# Altium project allaki_mezzanine.PrjPCB (part 2 of 2)

## Sheet FP_connectors.SchDoc: =ProjectName
size 420 x 297 mm; Author: SBH; CompanyName: WUT; DrawnBy: SBH; Organization: ISE-WUT; Address1: Warsaw Univeristy of Technology; Address2: Nowowiejska 15/19; Revision: -; SheetNumber: -; SheetTotal: -; EDA_Number: ARTIQ; Projet: ADC/DAC MEZZANINE; ModifiedBy: -; CreateDate: XX/XX/XXXX; CheckedDate: -; Title2: FP_connectors.SchDoc; DivGrp: ISE; Designer: SBH; ModifiedDate: -; ProjectName: ADC/DAC MEZZANINE
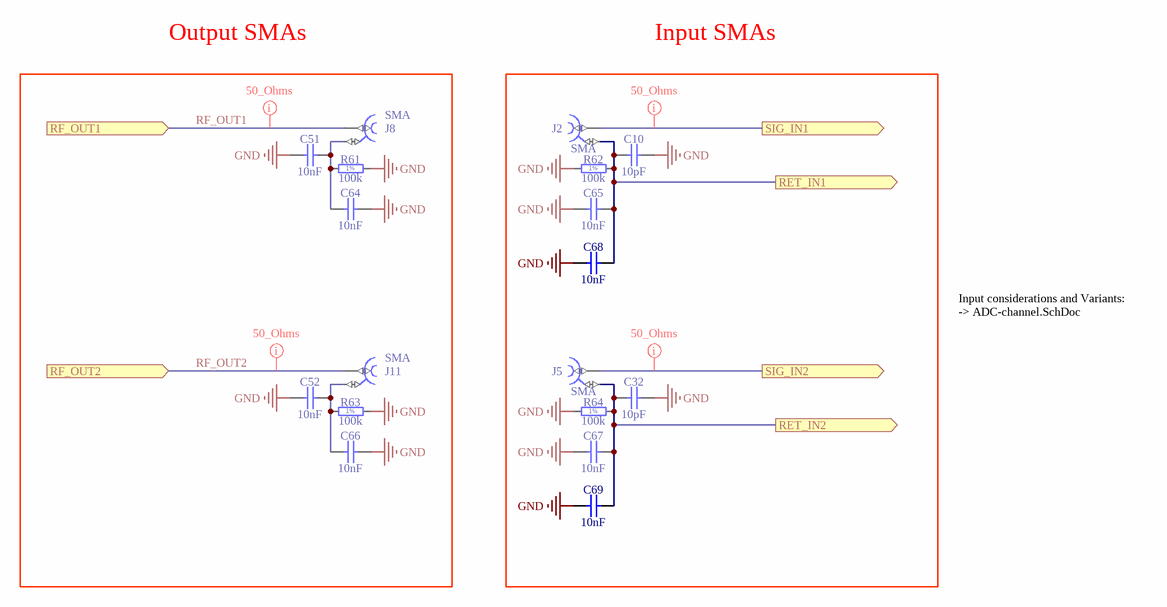
[diagram p3: FP_connectors.SchDoc]

### Parts
C10  10pF  [CAPC1005X55N]
C32  10pF  [CAPC1005X55N]
C51  10nF  [CAPC1005X55N]
C52  10nF  [CAPC1005X55N]
C64  10nF  [CAPC1005X55N]
C65  10nF  [CAPC1005X55N]
C66  10nF  [CAPC1005X55N]
C67  10nF  [CAPC1005X55N]
C68  10nF  [CAPC1005X55N]
C69  10nF  [CAPC1005X55N]
J2  SMA  [Telegartner_J01151A0921]
J5  SMA  [Telegartner_J01151A0921]
J8  SMA  [TELEGARTNER_J01151A0451]
J11  SMA  [TELEGARTNER_J01151A0451]
R61  100k  [RESC1005X40N]
R62  100k  [RESC1005X40N]
R63  100k  [RESC1005X40N]
R64  100k  [RESC1005X40N]

### Ports
RET_IN1 (out), RET_IN2 (out), RF_OUT1 (in), RF_OUT2 (in), SIG_IN1 (out), SIG_IN2 (out)

### Nets
GND: C10.2 C32.2 C51.1 C52.1 C64.2 C65.1 C66.2 C67.1 C68.1 C69.1 R61.1 R62.1 R63.1 R64.1
RET1_IN: C10.1 C65.2 C68.2 J2.2 R62.2 ; port RET_IN1
RET2_IN: C32.1 C67.2 C69.2 J5.2 R64.2 ; port RET_IN2
RF_OUT1: J8.1 ; port RF_OUT1  [project net RF1_OUT]
RF_OUT2: J11.1 ; port RF_OUT2  [project net RF2_OUT]
SIG1_IN: J2.1 ; port SIG_IN1
SIG2_IN: J5.1 ; port SIG_IN2
NetC51_2: C51.2 C64.1 J8.2 R61.2
NetC52_2: C52.2 C66.1 J11.2 R63.2

### Layout directives
net class 50_Ohms: RF1_OUT, RF2_OUT, SIG1_IN, SIG2_IN

### Notes on the sheet
- Output SMAs
- Input SMAs
- Input considerations and Variants:
  -> ADC-channel.SchDoc
- Project/Equipment
- Document
- Designer
- Drawn by
- Check.by
- File
- Last Mod.
- Print Date
- Sheet
- Size
- A3
- of
- Rev
- (in symbol R0402_100K_1%_0.0625W_100PPM) 1%

### Library data of the parts
C10 C32 = CC0402_10PF_50V_5%_C0G: Non-polarised capacitor; Part Description: SMD Multilayer Chip Ceramic Capacitor; Manufacturer: GENERIC; Manufacturer1 Part Number: C0402C100J5GACTU; Voltage: 50V; TC: C0G/NP0; Tolerance: ±5%; Part Number: CC0402_10PF_50V_5%_C0G; Component Kind: Standard; Component Type: Standard; Pin Count: 2; Value: 10pF; Status: Preferred; Manufacturer Part Number: CC0402_10PF_50V_5%_C0G; Case: 0402; Mounted: Yes; Socket: No; SMD: Yes; Sense: No; Manufacturer1 Example: KEMET; Manufacturer1 ComponentHeight: 0.55mm; HelpURL: \\cern.ch\dfs\Applications\Altium\Datasheets\CC0805_C0G_KEMET_(Commercial Grade).pdf; Author: CERN DEM JLC; CreateDate: 2007-12-03; LatestRevisionDate: 2015-04-22
C51 C52 C64-C69 = CC0402_10NF_16V_10%_X7R: Non-polarised capacitor; Part Description: SMD Multilayer Chip Ceramic Capacitor; Manufacturer: GENERIC; Manufacturer1 Part Number: 223878715636; Voltage: 16V; TC: X7R; Tolerance: ±10%; Part Number: CC0402_10NF_16V_10%_X7R; Component Kind: Standard; Component Type: Standard; Pin Count: 2; Value: 10nF; Status: Not Recommended; Manufacturer Part Number: CC0402_10NF_16V_10%_X7R; Case: 0402; Mounted: Yes; Socket: No; SMD: Yes; Sense: No; Manufacturer1 Example: PHYCOMP; Manufacturer1 ComponentHeight: 0.55mm; HelpURL: \\cern.ch\dfs\Applications\Altium\Datasheets\CC0402_X7R_PHYCOMP.pdf; Author: CERN DEM JLC; CreateDate: 2007-12-03; LatestRevisionDate: 2007-12-03
J2 J5 = SMA_RA_J01151A0921: RiSMA 50 Ohms Right Angle PCB Jack; Manufacturer: Telegartner; PressFit: No; Part Number: Telegartner_J01151A0921; Component Kind: Standard; Component Type: Standard; Pin Count: 2; Family: SMA; Mounted: Yes; Socket: No; SMD: No; Sense: No; Status: None; Part Description: SMA 50 Ohms Right Angle PCB Jack; Manufacturer Part Number: J01151A0921; ComponentHeight: 9.6mm; HelpURL: \\cern.ch\dfs\Applications\Altium\Datasheets\HUBER-SUHNER_85_SMA-50-0-101-111_NE.pdf; Author: GK; CreateDate: 11.11.2016; LatestRevisionDate: 11.11.2016
J8 J11 = TELEGARTNER_J01151A0451: Part Description: SMA 50 ohms Edge Mount Bulkhead Jack Receptacle; PressFit: No; Part Number: TELEGARTNER_J01151A0451; Component Kind: Standard; Component Type: Standard; Pin Count: 2; Family: SMA; Mounted: Yes; Socket: No; SMD: No; Sense: No; Status: None; Manufacturer: TELEGARTNER; Manufacturer Part Number: J01151A0451; ComponentHeight: 7mm; HelpURL: \\cern.ch\dfs\Applications\Altium\Datasheets\TELEGARTNER_J01151A0451.pdf; Author: CERN DEM JLC; CreateDate: 27.10.2016; LatestRevisionDate: 27.10.2016
R61-R64 = R0402_100K_1%_0.0625W_100PPM: Resistor - 1%; Part Description: General Purpose Thick Film Chip Resistor; Manufacturer: GENERIC; Manufacturer1 Part Number: 232270671004L; TC: ±100ppm/°C; Part Number: R0402_100K_1%_0.0625W_100PPM; Component Kind: Standard; Component Type: Standard; Pin Count: 2; Value: 100k; Status: Not recommended; Power: 0.0625W; Tolerance: ±1%; Manufacturer Part Number: R0402_100K_1%_0.0625W_100PPM; Case: 0402; Mounted: Yes; Sense: No; Socket: No; SMD: Yes; Manufacturer1 Example: YAGEO PHYCOMP; Manufacturer1 ComponentHeight: 0.4mm; HelpURL: \\cern.ch\dfs\Applications\Altium\Datasheets\R0402_Phycomp_RC0402.pdf; Author: CERN DEM JLC; CreateDate: 2007-12-03; LatestRevisionDate: 2012-10-17

## Sheet B2B_connectors .SchDoc: =ProjectName
size 420 x 297 mm; Author: SBH; CompanyName: WUT; DrawnBy: SBH; Organization: ISE-WUT; Address1: Warsaw Univeristy of Technology; Address2: Nowowiejska 15/19; Revision: -; SheetNumber: -; SheetTotal: -; EDA_Number: ARTIQ; Projet: ADC/DAC MEZZANINE; ModifiedBy: -; CreateDate: XX/XX/XXXX; CheckedDate: -; Title2: B2B_connectors .SchDoc; DivGrp: ISE; Designer: SBH; ModifiedDate: -; ProjectName: ADC/DAC MEZZANINE
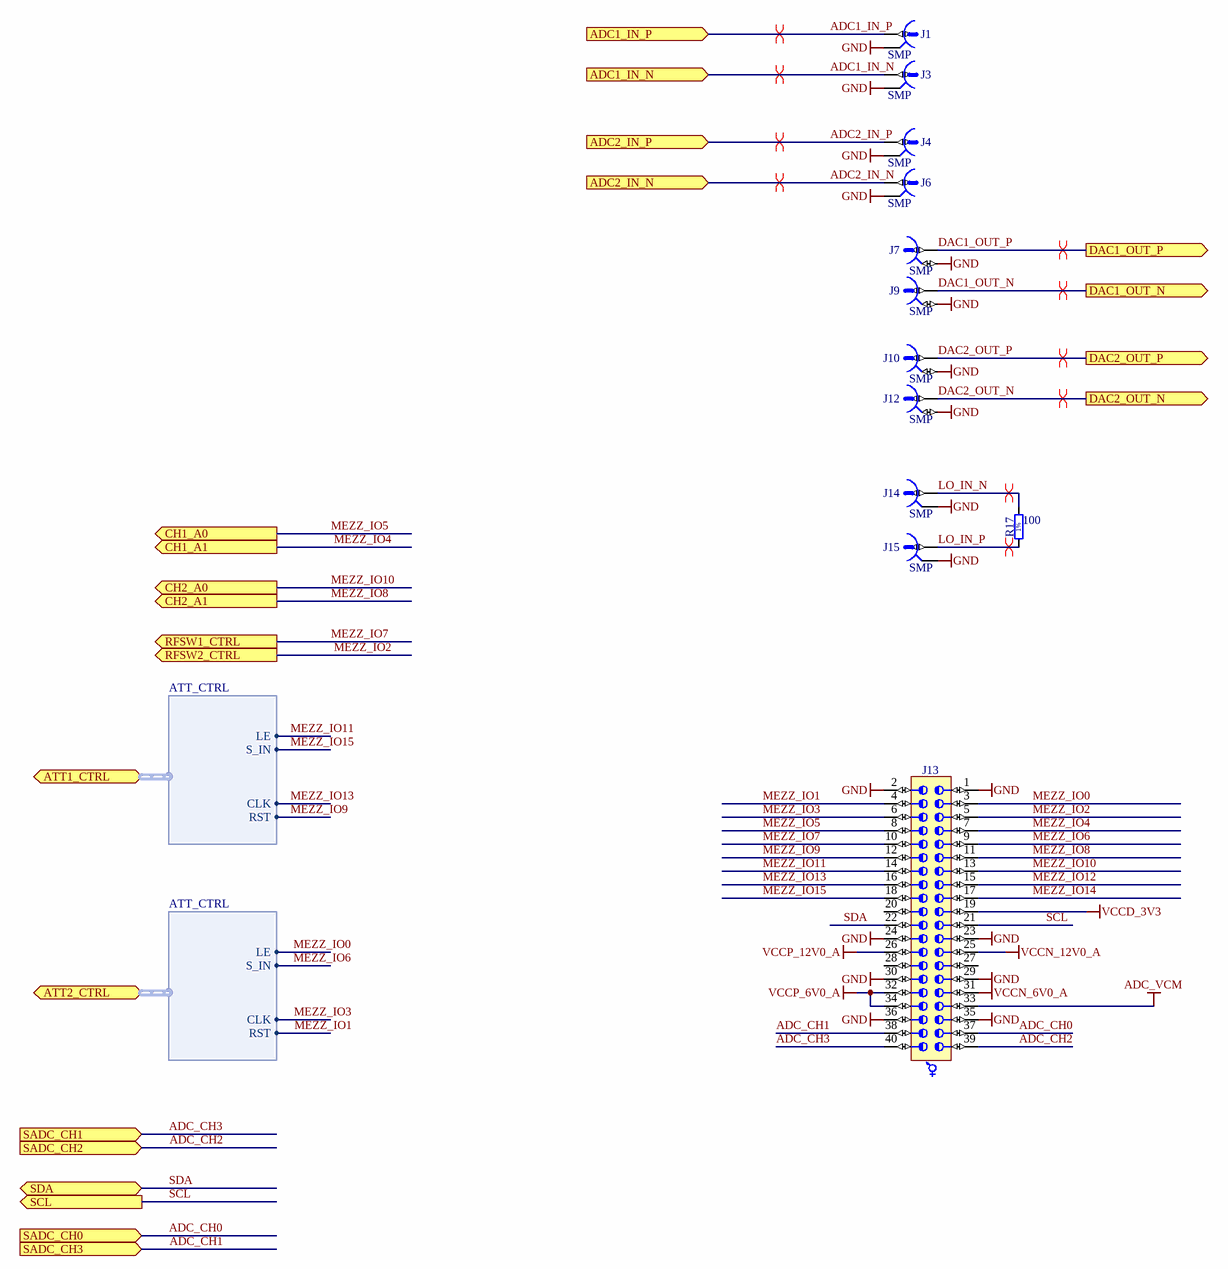
[diagram p4: B2B_connectors .SchDoc]

### Parts
J1  SMP  [AMPHENOL_SMP-MSLD-PCT-10]
J3  SMP  [AMPHENOL_SMP-MSLD-PCT-10]
J4  SMP  [AMPHENOL_SMP-MSLD-PCT-10]
J6  SMP  [AMPHENOL_SMP-MSLD-PCT-10]
J7  SMP  [MOLEX_85305-0232]
J9  SMP  [MOLEX_85305-0232]
J10  SMP  [MOLEX_85305-0232]
J12  SMP  [MOLEX_85305-0232]
J13  (no value)  [SAMTEC_LSS-120-02-L-DV-A]
J14  SMP  [AMPHENOL_SMP-MSLD-PCT-10]
J15  SMP  [AMPHENOL_SMP-MSLD-PCT-10]
R17  100  [RESC1005X40N]

### Ports
ADC1_IN_N (in), ADC1_IN_P (in), ADC2_IN_N (in), ADC2_IN_P (in), ATT1_CTRL (harness ATT_CTRL), ATT2_CTRL (harness ATT_CTRL), CH1_A0 (out), CH1_A1 (out), CH2_A0 (out), CH2_A1 (out), DAC1_OUT_N (out), DAC1_OUT_P (out), DAC2_OUT_N (out), DAC2_OUT_P (out), RFSW1_CTRL (out), RFSW2_CTRL (out), SADC_CH0 (in), SADC_CH1 (in), SADC_CH2 (in), SADC_CH3 (in), SCL (out), SDA (bidir)

### Harnesses
ATT_CTRL: LE, S_IN, CLK, RST

### Nets
ADC_VCM: J13.33
GND: J1.2 J3.2 J4.2 J6.2 J7.2 J9.2 J10.2 J12.2 J13.1 J13.2 J13.23 J13.24 J13.29 J13.30 J13.35 J13.36 J14.2 J15.2
VCCD_3V3: J13.19
VCCN_6V0_A: J13.31
VCCN_12V0_A: J13.25
VCCP_6V0_A: J13.32 J13.34
VCCP_12V0_A: J13.26
ADC1_IN_N: J3.1 ; port ADC1_IN_N
ADC1_IN_P: J1.1 ; port ADC1_IN_P
ADC2_IN_N: J6.1 ; port ADC2_IN_N
ADC2_IN_P: J4.1 ; port ADC2_IN_P
ADC_CH0: J13.37 ; port SADC_CH0
ADC_CH1: J13.38 ; port SADC_CH3
ADC_CH2: J13.39 ; port SADC_CH2
ADC_CH3: J13.40 ; port SADC_CH1
DAC1_OUT_N: J9.1 ; port DAC1_OUT_N
DAC1_OUT_P: J7.1 ; port DAC1_OUT_P
DAC2_OUT_N: J12.1 ; port DAC2_OUT_N
DAC2_OUT_P: J10.1 ; port DAC2_OUT_P
LO_IN_N: J14.1 R17.2
LO_IN_P: J15.1 R17.1
MEZZ_IO0: J13.3 ; port ATT2_CTRL.LE  [project net ATT2_CTRL.LE]
MEZZ_IO1: J13.4 ; port ATT2_CTRL.RST  [project net ATT2_CTRL.RST]
MEZZ_IO2: J13.5 ; port RFSW2_CTRL
MEZZ_IO3: J13.6 ; port ATT2_CTRL.CLK  [project net ATT2_CTRL.CLK]
MEZZ_IO4: J13.7 ; port CH1_A1
MEZZ_IO5: J13.8 ; port CH1_A0
MEZZ_IO6: J13.9 ; port ATT2_CTRL.S_IN  [project net ATT2_CTRL.S_IN]
MEZZ_IO7: J13.10 ; port RFSW1_CTRL
MEZZ_IO8: J13.11 ; port CH2_A1
MEZZ_IO9: J13.12 ; port ATT1_CTRL.RST  [project net ATT1_CTRL.RST]
MEZZ_IO10: J13.13 ; port CH2_A0
MEZZ_IO11: J13.14 ; port ATT1_CTRL.LE  [project net ATT1_CTRL.LE]
MEZZ_IO12: J13.15
MEZZ_IO13: J13.16 ; port ATT1_CTRL.CLK  [project net ATT1_CTRL.CLK]
MEZZ_IO14: J13.17
MEZZ_IO15: J13.18 ; port ATT1_CTRL.S_IN  [project net ATT1_CTRL.S_IN]
SCL: J13.21 ; port SCL
SDA: J13.22 ; port SDA

Not connected (* = marked no-connect by the designer): J13 20 27 28

### Layout directives
differential pair: ADC1_IN_N, ADC1_IN_P, ADC2_IN_N, ADC2_IN_P, DAC1_OUT_N, DAC1_OUT_P, DAC2_OUT_N, DAC2_OUT_P, LO_IN_N, LO_IN_P

### Notes on the sheet
- Project/Equipment
- Document
- Designer
- Drawn by
- Check.by
- File
- Last Mod.
- Print Date
- Sheet
- Size
- A3
- of
- Rev
- (in symbol R0402_100R_1%_0.0625W_100PPM) 1%

### Library data of the parts
J1 J3 J4 J6 J14 J15 = CON_SMP-MSLD-PCT-10: 50 Ohms, SMP Surface/THT Mount Plug, Limited Detent; Part Description: 50 Ohms, SMP Surface Mount Plug, Limited Detent; Manufacturer: AMPHENOL; PressFit: No; Part Number: AMPHENOL_SMP-MSLD-PCT-10; Component Kind: Standard; Component Type: Standard; Pin Count: 2; Family: SMP; Mounted: Yes; Socket: No; SMD: No; Sense: No; Status: None; Manufacturer Part Number: SMP-MSLD-PCT-10; ComponentHeight: 4.1mm; HelpURL: \\cern.ch\dfs\Applications\Altium\Datasheets\MOLEX_85305-0232.pdf; Author: GK; CreateDate: 11.11.2016; LatestRevisionDate: 11.11.2016
J7 J9 J10 J12 = MOLEX_85305-0232: Part Description: 50 Ohms, SMP Surface Mount Plug, Limited Detent; Manufacturer: MOLEX; PressFit: No; Part Number: MOLEX_85305-0232; Component Kind: Standard; Component Type: Standard; Pin Count: 2; Family: SMP; Mounted: Yes; Socket: No; SMD: Yes; Sense: No; Status: None; Manufacturer Part Number: 85305-0232; ComponentHeight: 4.1mm; HelpURL: \\cern.ch\dfs\Applications\Altium\Datasheets\MOLEX_85305-0232.pdf; Author: CERN DEM JMW; CreateDate: 09.08.2016; LatestRevisionDate: 09.08.2016
J13 = CON_SAMTEC_LSS-120-02-L-DV-A: 40 Contacts, Pitch 0.635mm, Razor Beam LSS Vertical High Speed Hermaphroditic Strip (Lead Style 7.49mm); Part Description: 40 Contacts, Pitch 0.635mm, Razor Beam LSS Vertical High Speed Hermaphroditic Strip (Lead Style 5.49mm); Manufacturer: SAMTEC; PressFit: No; Part Number: SAMTEC_LSS-120-02-L-DV-A; Component Kind: Standard; Component Type: Standard; Pin Count: 40; Mounted: Yes; Socket: No; Sense: No; SMD: Yes; Status: None; Manufacturer Part Number: LSS-120-02-L-DV-A; ComponentHeight: 5.57mm; HelpURL: \\cern.ch\dfs\Applications\Altium\Datasheets\SAMTEC_LSS-120-03-L-DV-A.pdf; Author: CERN DEM JMW; CreateDate: 10.11.2015; LatestRevisionDate: 10.11.2015
R17 = R0402_100R_1%_0.0625W_100PPM: Resistor - 1%; Part Description: General Purpose Thick Film Chip Resistor; Manufacturer: GENERIC; Manufacturer1 Part Number: 232270671001L; TC: ±100ppm/°C; Part Number: R0402_100R_1%_0.0625W_100PPM; Component Kind: Standard; Component Type: Standard; Pin Count: 2; Value: 100; Status: Not recommended; Power: 0.0625W; Tolerance: ±1%; Manufacturer Part Number: R0402_100R_1%_0.0625W_100PPM; Case: 0402; Mounted: Yes; Sense: No; Socket: No; SMD: Yes; Manufacturer1 Example: YAGEO PHYCOMP; Manufacturer1 ComponentHeight: 0.4mm; HelpURL: \\cern.ch\dfs\Applications\Altium\Datasheets\R0402_Phycomp_RC0402.pdf; Author: CERN DEM JLC; CreateDate: 03.12.2007; LatestRevisionDate: 17.10.2012

## Sheet PowerSupply.SchDoc: =ProjectName
size 420 x 297 mm; Author: SBH; CompanyName: WUT; DrawnBy: SBH; Organization: ISE-WUT; Address1: Warsaw Univeristy of Technology; Address2: Nowowiejska 15/19; Revision: -; SheetNumber: -; SheetTotal: -; EDA_Number: ARTIQ; Projet: ADC/DAC MEZZANINE; ModifiedBy: -; CreateDate: XX/XX/XXXX; CheckedDate: -; Title2: PowerSupply.SchDoc; DivGrp: ISE; Designer: SBH; ModifiedDate: -; ProjectName: ADC/DAC MEZZANINE
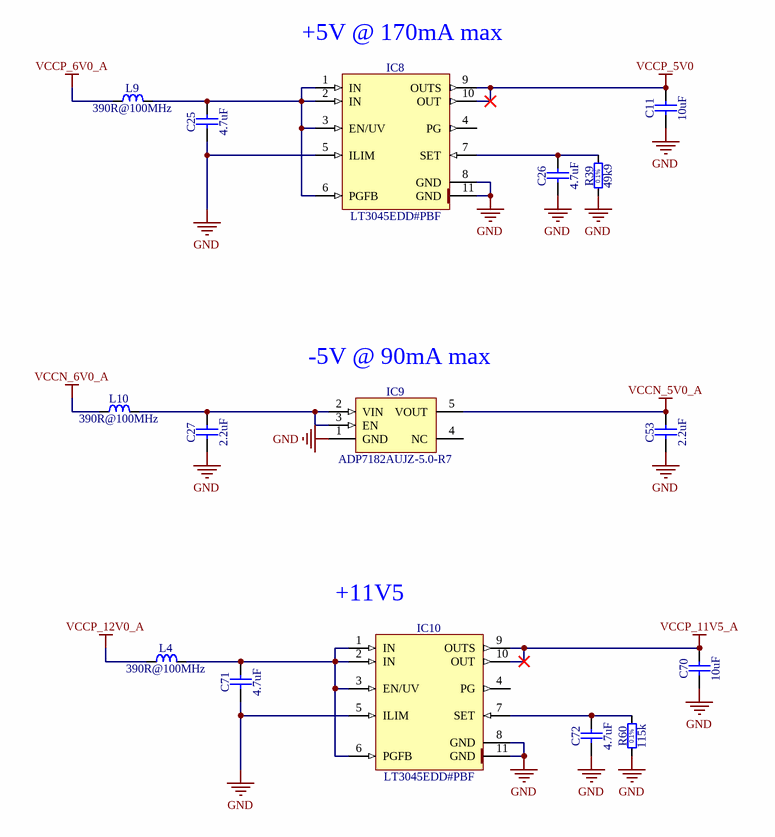
[diagram p5: PowerSupply.SchDoc]

### Parts
C11  10uF  [CAPC1608X87N]
C25  4.7uF  [CAPC1709X95N]
C26  4.7uF  [CAPC1709X95N]
C27  2.2uF  [CAPC1608X90N]
C53  2.2uF  [CAPC1608X90N]
C70  10uF  [CAPC1608X87N]
C71  4.7uF  [CAPC1709X95N]
C72  4.7uF  [CAPC1709X95N]
IC8  LT3045EDD#PBF  [SON50P300X300X80-11N-R175X248]
IC9  ADP7182AUJZ-5.0-R7  [SOT95P280X90-5N]
IC10  LT3045EDD#PBF  [SON50P300X300X80-11N-R175X248]
L4  390R@100MHz  [INDC1608X95N]
L9  390R@100MHz  [INDC1608X95N]
L10  390R@100MHz  [INDC1608X95N]
R39  49k9  [RESC1608X55N]
R60  115k  [RESC1608X55N]

### Nets
GND: C11.1 C25.1 C26.1 C27.1 C53.1 C70.1 C71.1 C72.1 IC8.5(ILIM) IC8.8(GND) IC8.11(GND) IC9.1(GND) IC10.5(ILIM) IC10.8(GND) IC10.11(GND) R39.1 R60.1
VCCN_5V0_A: C53.2 IC9.5(VOUT)
VCCN_6V0_A: L10.1
VCCP_5V0: C11.2 IC8.9(OUTS) IC8.10(OUT)
VCCP_6V0_A: L9.1
VCCP_11V5_A: C70.2 IC10.9(OUTS) IC10.10(OUT)
VCCP_12V0_A: L4.1
NetC25_2: C25.2 IC8.1(IN) IC8.2(IN) IC8.3(EN/UV) IC8.6(PGFB) L9.2
NetC26_2: C26.2 IC8.7(SET) R39.2
NetC27_2: C27.2 IC9.2(VIN) IC9.3(EN) L10.2
NetC71_2: C71.2 IC10.1(IN) IC10.2(IN) IC10.3(EN/UV) IC10.6(PGFB) L4.2
NetC72_2: C72.2 IC10.7(SET) R60.2

Not connected (* = marked no-connect by the designer): IC8 4(PG); IC9 4(NC); IC10 4(PG)

### Notes on the sheet
- (near IC8) +5V @ 170mA max
- (near IC9) -5V @ 90mA max
- (near IC10) +11V5
- Project/Equipment
- Document
- Designer
- Drawn by
- Check.by
- File
- Last Mod.
- Print Date
- Sheet
- Size
- A3
- of
- Rev
- (in symbol R0603_49K9_0.1%_0.063W_10PPM) 0.1%
- (in symbol R0603_115K_0.1%_0.063W_10PPM) 0.1%

### Library data of the parts
C11 C70 = CC0603_10UF_6.3V_20%_X5R: Non-polarised capacitor; Part Description: SMD Multilayer Chip Ceramic Capacitor; Manufacturer: GENERIC; Manufacturer1 Part Number: C0603C106M9PAC; Voltage: 6.3V; TC: X5R; Tolerance: ±20%; Part Number: CC0603_10UF_6.3V_20%_X5R; Component Kind: Standard; Component Type: Standard; Pin Count: 2; Value: 10uF; Status: Preferred; Manufacturer Part Number: CC0603_10uF_6.3V_20%_X5R; Case: 0603; Mounted: Yes; Socket: No; SMD: Yes; Sense: No; Manufacturer1 Example: KEMET; Manufacturer1 ComponentHeight: 0.95mm; HelpURL: \\cern.ch\dfs\Applications\Altium\Datasheets\CC0603_X5R_KEMET.pdf; Author: CERN DEM JLC; CreateDate: 2007-12-03; LatestRevisionDate: 2007-12-03
C25 C26 C71 C72 = CC0603_4.7UF_16V_10%_X5R: Non-polarised capacitor; Part Description: SMD Multilayer Chip Ceramic Capacitor; Manufacturer: GENERIC; Manufacturer1 Part Number: EMK107ABJ475KA-T; Voltage: 16V; TC: X5R; Tolerance: ±10%; Part Number: CC0603_4.7UF_16V_10%_X5R; Component Kind: Standard; Component Type: Standard; Pin Count: 2; Value: 4.7uF; Status: None; Manufacturer Part Number: CC0603_4.7UF_16V_10%_X5R; Case: 0603; Mounted: Yes; Socket: No; SMD: Yes; Sense: No; Manufacturer1 Example: TAIYO YUDEN; Manufacturer1 ComponentHeight: 0.95mm; HelpURL: \\cern.ch\dfs\Applications\Altium\Datasheets\CC0603_X7R_TAIYO-YUDEN_HIGH-VALUE.pdf; Author: CERN DEM JLC; CreateDate: 2013-12-16; LatestRevisionDate: 2014-09-16
C27 C53 = CC0603_2.2UF_10V_20%_X7R: Non-polarised capacitor; Part Description: SMD Multilayer Chip Ceramic Capacitor; Manufacturer: GENERIC; Manufacturer1 Part Number: LMK107B7225MA-T; Voltage: 10V; TC: X7R; Tolerance: ±20%; Part Number: CC0603_2.2UF_10V_20%_X7R; Component Kind: Standard; Component Type: Standard; Pin Count: 2; Value: 2.2uF; Status: Not Recommended; Manufacturer Part Number: CC0603_2.2UF_10V_20%_X7R; Case: 0603; Mounted: Yes; Socket: No; SMD: Yes; Sense: No; Manufacturer1 Example: TAIYO YUDEN; Manufacturer1 ComponentHeight: 0.9mm; HelpURL: \\cern.ch\dfs\Applications\Altium\Datasheets\CC0603_X7R_TAIYO-YUDEN_HIGH-VALUE.pdf; Author: CERN DEM JLC; CreateDate: 2011-06-22; LatestRevisionDate: 2011-06-27
IC8 IC10 = LT3045EDD#PBF: 20V, 500mA, Ultralow Noise, Ultrahigh PSRR Linear Regulator; Manufacturer: LINEAR TECHNOLOGY; PressFit: No; Bonding: No; Part Number: LT3045EDD#PBF; Component Kind: Standard; Component Type: Standard; Device: LT3045EDD#PBF; PackageDescription: SON, 0.50mm Pitch, 10-pin, 3.00mm W  X 3.00mm L X 0.80mm Height, (w/thermal tab 1.75 X 2.48 mm), IPC Medium Density; Part Description: 20V, 500mA, Ultralow Noise, Ultrahigh PSRR Linear Regulator; Manufacturer Part Number: LT3045EDD#PBF; Pin Count: 11; Case: SON10; Mounted: Yes; Socket: No; SMD: Yes; Sense: No; ComponentHeight: 0.8mm; HelpURL: \\cern.ch\dfs\Applications\Altium\Datasheets\LT3045EDD#PBF.pdf; Author: CERN DEM JLC; CreateDate: 2016-12-07; LatestRevisionDate: 2016-12-07
IC9 = ADP7182AUJZ-5.0-R7: –5V, 200 mA, Low Noise, Linear Regulator; Part Description: –5V, -200mA, Low Noise, Linear Regulator; Manufacturer: ANALOG DEVICES; PressFit: No; Bonding: No; Part Number: ADP7182AUJZ-5.0-R7; Component Kind: Standard; Component Type: Standard; Device: ADP7182AUJZ-5.0-R7; PackageDescription: SOT23, 0.95mm pitch; 5 pin, 1.75mm W X 3.00mm L, IPC Medium Density; Manufacturer Part Number: ADP7182AUJZ-5.0-R7; Pin Count: 5; Case: SOT23-5; Mounted: Yes; Socket: No; SMD: Yes; Sense: No; ComponentHeight: 0.9mm; HelpURL: \\cern.ch\dfs\Applications\Altium\Datasheets\ADP7182AUJZ-5.0-R7.pdf; Author: CERN DEM JLC; CreateDate: 17.03.2014; LatestRevisionDate: 17.03.2014
L4 L9 L10 = IND0603_TDK_MPZ1608R391A: Inductor; Part Description: SMT Chip Bead for Power Line; Manufacturer: TDK; Power: 1.2A; Resistance: 0.12R; Tolerance: ±25%; Part Number: IND0603_TDK_MPZ1608R391A; Component Kind: Standard; Component Type: Standard; Pin Count: 2; Value: 390R@100MHz; Status: None; Manufacturer Part Number: MPZ1608R391A; Case: 0603; Mounted: Yes; Socket: No; SMD: Yes; Sense: No; ComponentHeight: 0.95mm; HelpURL: \\cern.ch\dfs\Applications\Altium\Datasheets\IND0603_TDK_MPZ1608.pdf; Author: CERN DEM JLC; CreateDate: 2009-12-02; LatestRevisionDate: 2009-12-02
R39 = R0603_49K9_0.1%_0.063W_10PPM: Resistor - 0.1%; Part Description: Thin Film Chip Resistor; Manufacturer: GENERIC; Manufacturer1 Part Number: RN73C1J49K9BTDF; Power: 0.063W; TC: ±10ppm; Part Number: R0603_49K9_0.1%_0.063W_10PPM; Component Kind: Standard; Component Type: Standard; Pin Count: 2; Value: 49k9; Status: Not recommended; Tolerance: ±0.1%; Manufacturer Part Number: R0603_49K9_0.1%_0.063W_10PPM; Case: 0603; Mounted: Yes; Sense: No; Socket: No; SMD: Yes; Manufacturer1 Example: TYCO HOLSWORTHY; Manufacturer1 ComponentHeight: 0.5mm; HelpURL: \\cern.ch\dfs\Applications\Altium\Datasheets\R0603_Tyco_RN73.pdf; Author: CERN DEM JLC; CreateDate: 2007-12-03; LatestRevisionDate: 2008-03-13
R60 = R0603_115K_0.1%_0.063W_10PPM: Resistor - 0.1%; Part Description: Thin Film Chip Resistor; Manufacturer: GENERIC; Manufacturer1 Part Number: RN73C1J115KBTDF; Power: 0.063W; TC: ±10ppm; Part Number: R0603_115K_0.1%_0.063W_10PPM; Component Kind: Standard; Component Type: Standard; Pin Count: 2; Value: 115k; Status: Not recommended; Tolerance: ±0.1%; Manufacturer Part Number: R0603_115K_0.1%_0.063W_10PPM; Case: 0603; Mounted: Yes; Sense: No; Socket: No; SMD: Yes; Manufacturer1 Example: TYCO HOLSWORTHY; Manufacturer1 ComponentHeight: 0.5mm; HelpURL: \\cern.ch\dfs\Applications\Altium\Datasheets\R0603_Tyco_RN73.pdf; Author: CERN DEM JLC; CreateDate: 2007-12-03; LatestRevisionDate: 2008-03-13

## Sheet Mgmt.SchDoc: =ProjectName
size 420 x 297 mm; Author: SBH; CompanyName: WUT; DrawnBy: SBH; Organization: ISE-WUT; Address1: Warsaw Univeristy of Technology; Address2: Nowowiejska 15/19; Revision: -; SheetNumber: 7; SheetTotal: 7; EDA_Number: ARTIQ; Projet: ARTIQ_ALTIUM/PCB_mezzanine_analog_allaki; ModifiedBy: -; CreateDate: XX/XX/XXXX; CheckedDate: -; Title2: Mgmt.SchDoc; DivGrp: ISE; Designer: SBH; ModifiedDate: -; ProjectName: ARTIQ_ALTIUM/PCB_mezzanine_analog_allaki
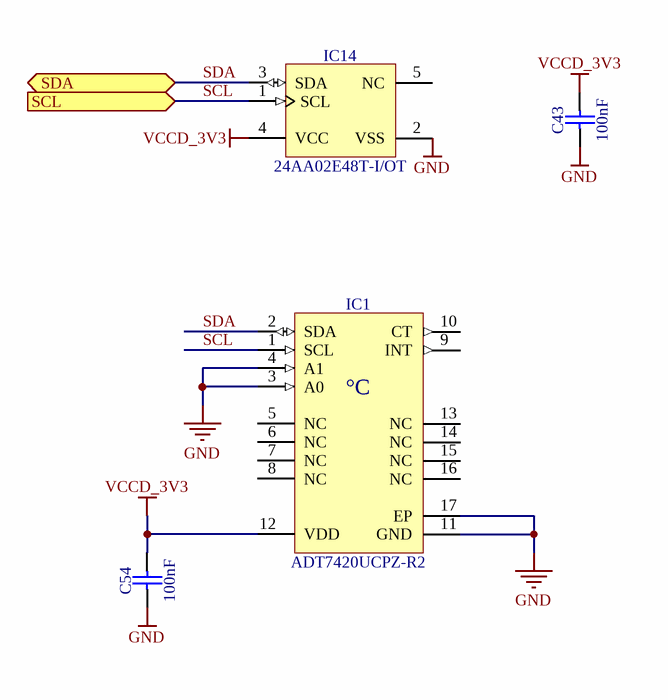
[diagram p6: Mgmt.SchDoc]

### Parts
C43  100nF  [CAPC1005X55N]
C54  100nF  [CAPC1005X55N]
IC1  ADT7420UCPZ-R2  [QFN65P400X400X80-17N-S270]
IC14  24AA02E48T-I/OT  [SOT95P280X145-5N]

### Ports
SCL (in), SDA (bidir)

### Nets
GND: C43.1 C54.1 IC1.3(A0) IC1.4(A1) IC1.11(GND) IC1.17(EP) IC14.2(VSS)
VCCD_3V3: C43.2 C54.2 IC1.12(VDD) IC14.4(VCC)
SCL: IC1.1(SCL) IC14.1(SCL) ; port SCL
SDA: IC1.2(SDA) IC14.3(SDA) ; port SDA

Not connected (* = marked no-connect by the designer): IC1 5(NC) 6(NC) 7(NC) 8(NC) 9(INT) 10(CT) 13(NC) 14(NC) 15(NC) 16(NC); IC14 5(NC)

### Notes on the sheet
- Project/Equipment
- Document
- Designer
- Drawn by
- Check.by
- File
- Last Mod.
- Print Date
- Sheet
- Size
- A3
- of
- Rev
- (in symbol ADT7420UCPZ-R2) °C

### Library data of the parts
C43 C54 = CC0402_100NF_16V_10%_X5R: Non-polarised capacitor; Part Description: SMD Multilayer Chip Ceramic Capacitor; Manufacturer: GENERIC; Manufacturer1 Part Number: GRM155R61C104KA88D; Voltage: 16V; TC: X5R; Tolerance: ±10%; Part Number: CC0402_100NF_16V_10%_X5R; Component Kind: Standard; Component Type: Standard; Pin Count: 2; Value: 100nF; Status: None; Manufacturer Part Number: CC0402_100NF_16V_10%_X5R; Case: 0402; Mounted: Yes; Socket: No; SMD: Yes; Sense: No; Manufacturer1 Example: MURATA; Manufacturer1 ComponentHeight: 0.55mm; HelpURL: \\cern.ch\dfs\Applications\Altium\Datasheets\CC0402_X5R_MURATA_GRM.pdf; Author: CERN DEM JLC; CreateDate: 10.12.2013; LatestRevisionDate: 10.12.2013
IC1 = ADT7420UCPZ-R2: ±0.25°C Accurate, 16-Bit Digital I2C Temperature Sensor; Part Description: -20° to +105°C ±0.25°C Accurate, 16-Bit Digital I2C Temperature Sensor; Manufacturer: ANALOG DEVICES; PressFit: No; Bonding: No; Part Number: ADT7420UCPZ-R2; Component Kind: Standard; Component Type: Standard; Device: ADT7420UCPZ-R2; PackageDescription: QFN, 0.65mm Pitch, Square; 16 Pin, 4.00mm L X 4.00mm W X 0.80mm H Body (w/thermal tab 2.7 X 2.7mm),  IPC Medium Density; Manufacturer Part Number: ADT7420UCPZ-R2; Pin Count: 8; Case: QFN16; Mounted: Yes; Socket: No; SMD: Yes; Sense: No; ComponentHeight: 0.8mm; HelpURL: \\cern.ch\dfs\Applications\Altium\Datasheets\ADT7420UCPZ-R2.pdf; Author: CERN DEM JLC; CreateDate: 2013-02-21; LatestRevisionDate: 2013-02-21
IC14 = 24AA02E48T-I/OT: 1.7V-5.5V, 2K I2C Serial EEPROM With EUI-48 Node Identity; Manufacturer: MICROCHIP TECHNOLOGY; PressFit: No; Bonding: No; Part Number: 24AA02E48T-I/OT; Component Kind: Standard; Component Type: Standard; Device: 24AA02E48T-I/OT; PackageDescription: SOT, 0.95mm pitch; 5 pin, 1.60mm W X 2.90mm L X 1.45mm H body, IPC Medium Density; Part Description: 1.7V-5.5V, 2K I2C Serial EEPROM With EUI-48 Node Identity; Manufacturer Part Number: 24AA02E48T-I/OT; Pin Count: 5; Case: SOT23-5; Mounted: Yes; Socket: No; SMD: Yes; Sense: No; ComponentHeight: 1.45mm; HelpURL: \\cern.ch\dfs\Applications\Altium\Datasheets\24AA02E48T-I-OT.pdf; Author: CERN DEM MR; CreateDate: 31.03.2016; LatestRevisionDate: 31.03.2016

## Nets that join several sheets
ADC_VCM: U_ADC_channel1 (L2A.1), U_ADC_channel2 (L2B.1), B2B_connectors  (J13.33)
GND: U_ADC_channel1 (24 pins), U_DAC_channel1 (78 pins), U_ADC_channel2 (24 pins), U_DAC_channel2 (78 pins), FP_connectors (14 pins), B2B_connectors  (18 pins), PowerSupply (17 pins), Mgmt (7 pins)
VCCD_3V3: B2B_connectors  (J13.19), Mgmt (C43.2 C54.2 IC1.12 IC14.4)
VCCN_5V0_A: U_ADC_channel1 (L5A.1), U_ADC_channel2 (L5B.1), PowerSupply (C53.2 IC9.5)
VCCN_6V0_A: B2B_connectors  (J13.31), PowerSupply (L10.1)
VCCN_12V0_A: U_ADC_channel1 (6 pins), U_ADC_channel2 (6 pins), B2B_connectors  (J13.25)
VCCP_5V0: U_ADC_channel1 (L3A.2), U_DAC_channel1 (L6A.2 L7A.1 L8A.2), U_ADC_channel2 (L3B.2), U_DAC_channel2 (L6B.2 L7B.1 L8B.2), PowerSupply (C11.2 IC8.9 IC8.10)
VCCP_6V0_A: B2B_connectors  (J13.32 J13.34), PowerSupply (L9.1)
VCCP_11V5_A: U_DAC_channel1 (C12A.2 C13A.2 R5A.1), U_DAC_channel2 (C12B.2 C13B.2 R5B.1), PowerSupply (C70.2 IC10.9 IC10.10)
VCCP_12V0_A: U_ADC_channel1 (5 pins), U_ADC_channel2 (5 pins), B2B_connectors  (J13.26), PowerSupply (L4.1)
ADC1_IN_N: U_ADC_channel1 (C63A.1 R42A.1), B2B_connectors  (J3.1)
ADC1_IN_P: U_ADC_channel1 (C63A.2 R40A.1), B2B_connectors  (J1.1)
ADC2_IN_N: U_ADC_channel2 (C63B.1 R42B.1), B2B_connectors  (J6.1)
ADC2_IN_P: U_ADC_channel2 (C63B.2 R40B.1), B2B_connectors  (J4.1)
ADC_CH0: U_DAC_channel1 (U1A.8), B2B_connectors  (J13.37)
ADC_CH1: U_DAC_channel2 (U1B.8), B2B_connectors  (J13.38)
ADC_CH2: U_DAC_channel2 (R26B.2 R27B.2), B2B_connectors  (J13.39)
ADC_CH3: U_DAC_channel1 (R26A.2 R27A.2), B2B_connectors  (J13.40)
ATT1_CTRL.CLK: U_DAC_channel1 (IC3A.21), B2B_connectors  (J13.16)
ATT1_CTRL.LE: U_DAC_channel1 (IC3A.22), B2B_connectors  (J13.14)
ATT1_CTRL.RST: U_DAC_channel1 (IC3A.20), B2B_connectors  (J13.12)
ATT1_CTRL.S_IN: U_DAC_channel1 (IC3A.24), B2B_connectors  (J13.18)
ATT2_CTRL.CLK: U_DAC_channel2 (IC3B.21), B2B_connectors  (J13.6)
ATT2_CTRL.LE: U_DAC_channel2 (IC3B.22), B2B_connectors  (J13.3)
ATT2_CTRL.RST: U_DAC_channel2 (IC3B.20), B2B_connectors  (J13.4)
ATT2_CTRL.S_IN: U_DAC_channel2 (IC3B.24), B2B_connectors  (J13.9)
DAC1_OUT_N: U_DAC_channel1 (C46A.1), B2B_connectors  (J9.1)
DAC1_OUT_P: U_DAC_channel1 (C37A.1), B2B_connectors  (J7.1)
DAC2_OUT_N: U_DAC_channel2 (C46B.1), B2B_connectors  (J12.1)
DAC2_OUT_P: U_DAC_channel2 (C37B.1), B2B_connectors  (J10.1)
MEZZ_IO2: U_DAC_channel2 (IC7B.2 R20B.2), B2B_connectors  (J13.5)
MEZZ_IO4: U_ADC_channel1 (IC6A.5), B2B_connectors  (J13.7)
MEZZ_IO5: U_ADC_channel1 (IC6A.4), B2B_connectors  (J13.8)
MEZZ_IO7: U_DAC_channel1 (IC7A.2 R20A.2), B2B_connectors  (J13.10)
MEZZ_IO8: U_ADC_channel2 (IC6B.5), B2B_connectors  (J13.11)
MEZZ_IO10: U_ADC_channel2 (IC6B.4), B2B_connectors  (J13.13)
RET1_IN: U_ADC_channel1 (R35A.1), FP_connectors (5 pins)
RET2_IN: U_ADC_channel2 (R35B.1), FP_connectors (5 pins)
RF1_OUT: U_DAC_channel1 (C50A.2), FP_connectors (J8.1)
RF2_OUT: U_DAC_channel2 (C50B.2), FP_connectors (J11.1)
SCL: B2B_connectors  (J13.21), Mgmt (IC1.1 IC14.1)
SDA: B2B_connectors  (J13.22), Mgmt (IC1.2 IC14.3)
SIG1_IN: U_ADC_channel1 (R6A.1), FP_connectors (J2.1)
SIG2_IN: U_ADC_channel2 (R6B.1), FP_connectors (J5.1)